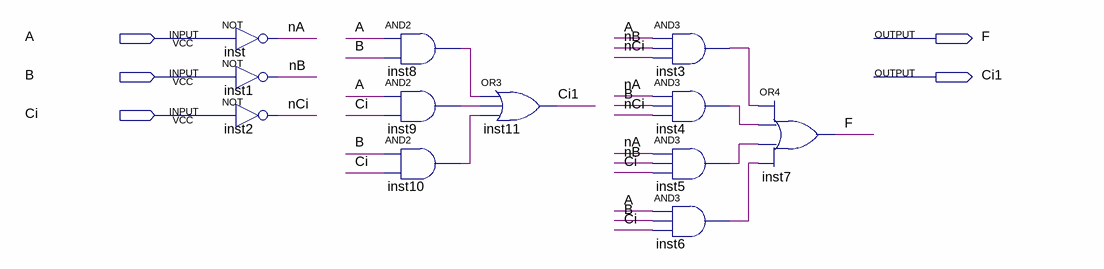
[diagram p0: schematic sheet]
// Quartus schematic ADD1.bdf as structural Verilog: 12 symbols, 5 pins
module ADD1 (
  input  A,
  input  B,
  input  Ci,
  output F,
  output Ci1
);

  wire inst3_out, inst4_out, inst5_out, inst6_out, inst8_out, inst9_out, inst10_out, nA, nB, nCi;

  not inst (nA, A);
  not inst1 (nB, B);
  not inst2 (nCi, Ci);
  and inst8 (inst8_out, A, B);
  and inst9 (inst9_out, A, Ci);
  and inst10 (inst10_out, B, Ci);
  or inst11 (Ci1, inst8_out, inst9_out, inst10_out);
  and inst3 (inst3_out, A, nB, nCi);
  and inst4 (inst4_out, nA, B, nCi);
  and inst5 (inst5_out, nA, nB, Ci);
  and inst6 (inst6_out, A, B, Ci);
  or inst7 (F, inst3_out, inst4_out, inst5_out, inst6_out);
endmodule
